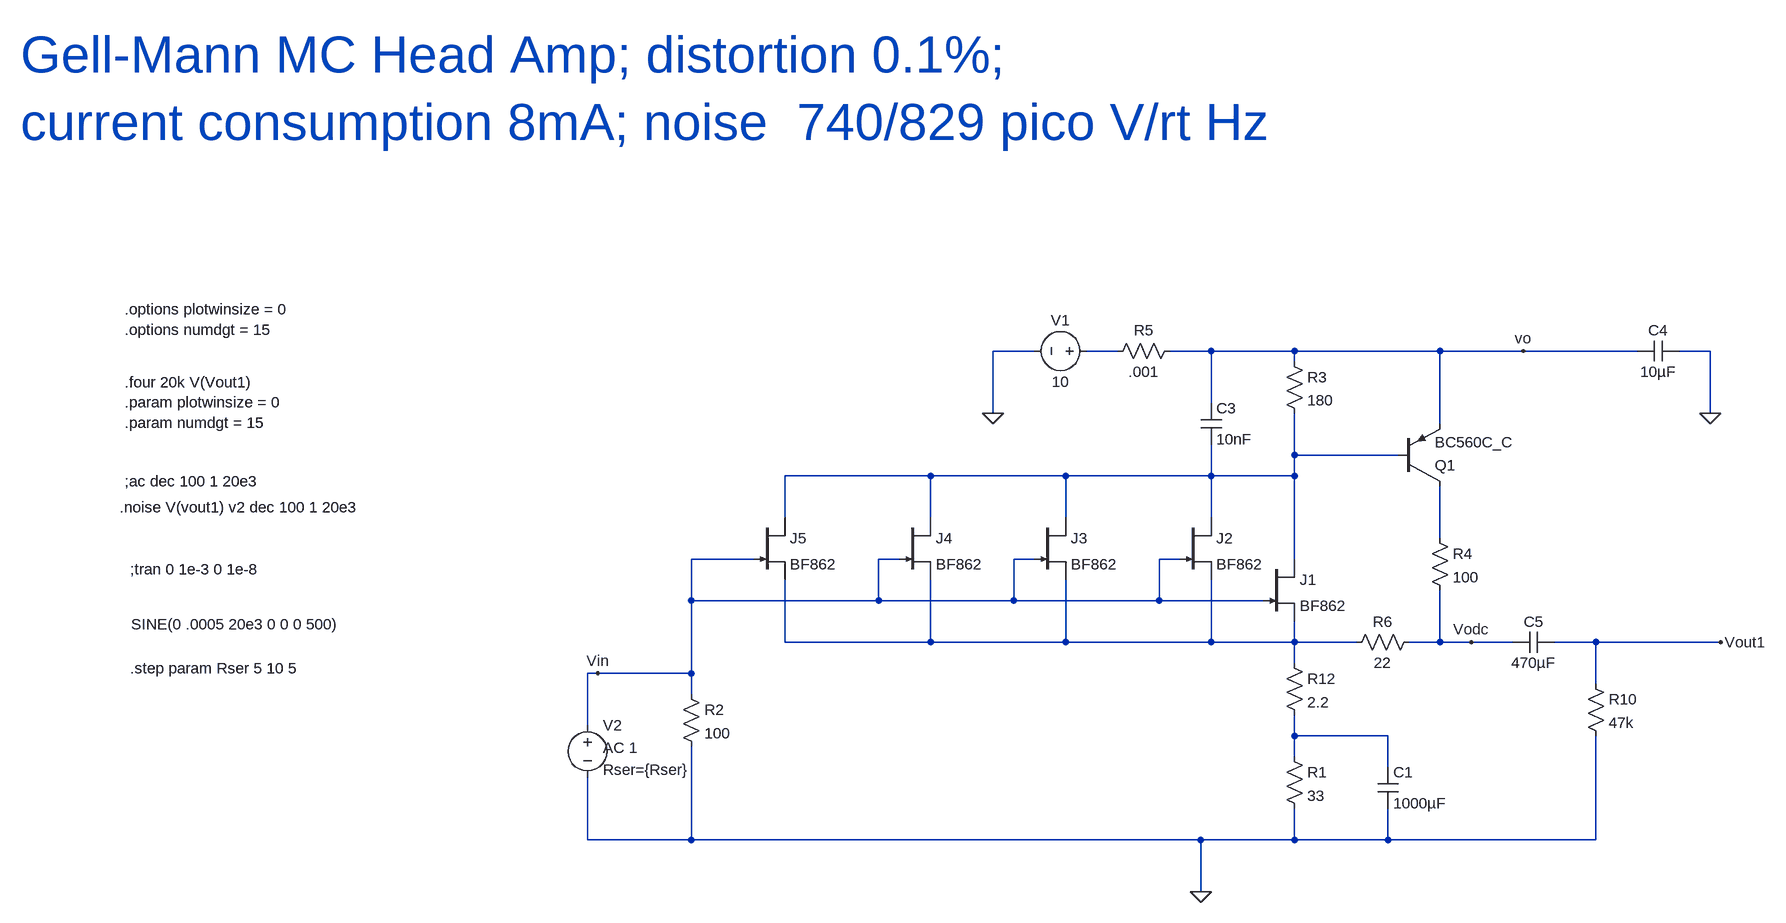
[diagram p0: schematic Gell_Mann.asc]
Gell_Mann.asc, the LTspice schematic file:
Version 4
SHEET 1 2320 680
WIRE 736 -496 672 -496
WIRE 864 -496 816 -496
WIRE 1008 -496 944 -496
WIRE 1136 -496 1008 -496
WIRE 1360 -496 1136 -496
WIRE 1488 -496 1360 -496
WIRE 1664 -496 1488 -496
WIRE 1776 -496 1728 -496
WIRE 1136 -480 1136 -496
WIRE 1008 -416 1008 -496
WIRE 672 -400 672 -496
WIRE 1776 -400 1776 -496
WIRE 1360 -384 1360 -496
WIRE 1136 -336 1136 -400
WIRE 1296 -336 1136 -336
WIRE 576 -304 352 -304
WIRE 784 -304 576 -304
WIRE 1008 -304 1008 -352
WIRE 1008 -304 784 -304
WIRE 1136 -304 1136 -336
WIRE 1136 -304 1008 -304
WIRE 352 -240 352 -304
WIRE 576 -240 576 -304
WIRE 784 -240 784 -304
WIRE 1008 -240 1008 -304
WIRE 1360 -208 1360 -288
WIRE 304 -176 208 -176
WIRE 528 -176 496 -176
WIRE 736 -176 704 -176
WIRE 960 -176 928 -176
WIRE 1136 -176 1136 -304
WIRE 208 -112 208 -176
WIRE 496 -112 496 -176
WIRE 496 -112 208 -112
WIRE 704 -112 704 -176
WIRE 704 -112 496 -112
WIRE 928 -112 928 -176
WIRE 928 -112 704 -112
WIRE 1088 -112 928 -112
WIRE 352 -48 352 -144
WIRE 576 -48 576 -144
WIRE 576 -48 352 -48
WIRE 784 -48 784 -144
WIRE 784 -48 576 -48
WIRE 1008 -48 1008 -144
WIRE 1008 -48 784 -48
WIRE 1136 -48 1136 -80
WIRE 1136 -48 1008 -48
WIRE 1232 -48 1136 -48
WIRE 1360 -48 1360 -128
WIRE 1360 -48 1312 -48
WIRE 1408 -48 1360 -48
WIRE 1472 -48 1408 -48
WIRE 1600 -48 1536 -48
WIRE 1792 -48 1600 -48
WIRE 1136 -16 1136 -48
WIRE 64 0 48 0
WIRE 208 0 208 -112
WIRE 208 0 64 0
WIRE 1600 16 1600 -48
WIRE 208 32 208 0
WIRE 48 80 48 0
WIRE 1136 96 1136 64
WIRE 1280 96 1136 96
WIRE 1136 128 1136 96
WIRE 1280 144 1280 96
WIRE 48 256 48 160
WIRE 208 256 208 112
WIRE 208 256 48 256
WIRE 992 256 208 256
WIRE 1136 256 1136 208
WIRE 1136 256 992 256
WIRE 1280 256 1280 208
WIRE 1280 256 1136 256
WIRE 1600 256 1600 96
WIRE 1600 256 1280 256
WIRE 992 336 992 256
FLAG 992 336 0
FLAG 672 -400 0
FLAG 1776 -400 0
FLAG 1792 -48 Vout1
FLAG 1408 -48 Vodc
FLAG 1488 -496 vo
FLAG 64 0 Vin
SYMBOL njf 1088 -176 R0
SYMATTR InstName J1
SYMATTR Value BF862
SYMBOL res 1120 112 R0
SYMATTR InstName R1
SYMATTR Value 33
SYMBOL res 1120 -496 R0
SYMATTR InstName R3
SYMATTR Value 180
SYMBOL voltage 832 -496 R90
WINDOW 0 -32 56 VBottom 2
WINDOW 3 32 56 VTop 2
WINDOW 123 2 56 VBottom 2
WINDOW 39 0 0 Left 2
SYMATTR InstName V1
SYMATTR Value 10
SYMBOL voltage 48 64 R0
WINDOW 3 -702 -140 Left 2
WINDOW 123 24 50 Left 2
WINDOW 39 24 84 Left 2
SYMATTR Value SINE(0 .0005 20e3 0 0 0 500)
SYMATTR Value2 AC 1
SYMATTR SpiceLine Rser={Rser}
SYMATTR InstName V2
SYMBOL cap 1728 -512 R90
WINDOW 0 0 32 VBottom 2
WINDOW 3 32 32 VTop 2
SYMATTR InstName C4
SYMATTR Value 10µF
SYMBOL pnp 1296 -288 M180
SYMATTR InstName Q1
SYMATTR Value BC560C_C
SYMBOL res 192 16 R0
SYMATTR InstName R2
SYMATTR Value 100
SYMBOL res 1344 -224 R0
SYMATTR InstName R4
SYMATTR Value 100
SYMBOL cap 992 -416 R0
SYMATTR InstName C3
SYMATTR Value 10nF
SYMBOL cap 1536 -64 R90
WINDOW 0 0 32 VBottom 2
WINDOW 3 32 32 VTop 2
SYMATTR InstName C5
SYMATTR Value 470µF
SYMBOL res 1584 0 R0
SYMATTR InstName R10
SYMATTR Value 47k
SYMBOL res 1120 -32 R0
SYMATTR InstName R12
SYMATTR Value 2.2
SYMBOL cap 1264 144 R0
SYMATTR InstName C1
SYMATTR Value 1000µF
SYMBOL res 960 -512 R90
WINDOW 0 0 56 VBottom 2
WINDOW 3 32 56 VTop 2
SYMATTR InstName R5
SYMATTR Value .001
SYMBOL njf 960 -240 R0
SYMATTR InstName J2
SYMATTR Value BF862
SYMBOL njf 736 -240 R0
SYMATTR InstName J3
SYMATTR Value BF862
SYMBOL njf 528 -240 R0
SYMATTR InstName J4
SYMATTR Value BF862
SYMBOL njf 304 -240 R0
SYMATTR InstName J5
SYMATTR Value BF862
SYMBOL res 1328 -64 R90
WINDOW 0 0 56 VBottom 2
WINDOW 3 32 56 VTop 2
SYMATTR InstName R6
SYMATTR Value 22
TEXT -664 -296 Left 2 !;ac dec 100 1 20e3
TEXT -656 -160 Left 2 !;tran 0 1e-3 0 1e-8
TEXT -672 -256 Left 2 !.noise V(vout1) v2 dec 100 1 20e3
TEXT -664 -448 Left 2 !.four 20k V(Vout1)\n.param plotwinsize = 0\n.param numdgt = 15
TEXT -664 -560 Left 2 !.options plotwinsize = 0\n.options numdgt = 15
TEXT -656 -8 Left 2 !.step param Rser 5 10 5
TEXT -824 -952 Left 6 ;Gell-Mann MC Head Amp; distortion 0.1%; \ncurrent consumption 8mA; noise  740/829 pico V/rt Hz

The netlist it stands for:
* Gell_Mann.asc
J1 N002 Vin N004 BF862
R1 N005 0 33
R3 vo N002 180
V1 N001 0 10
V2 Vin 0 SINE(0 .0005 20e3 0 0 0 500) AC 1 Rser={Rser}
C4 0 vo 10µF
Q1 N003 N002 vo 0 BC560C_C
R2 Vin 0 100
R4 N003 Vodc 100
C3 vo N002 10nF
C5 Vout1 Vodc 470µF
R10 Vout1 0 47k
R12 N004 N005 2.2
C1 N005 0 1000µF
R5 vo N001 .001
J2 N002 Vin N004 BF862
J3 N002 Vin N004 BF862
J4 N002 Vin N004 BF862
J5 N002 Vin N004 BF862
R6 Vodc N004 22
.model NPN NPN
.model PNP PNP
.lib standard.bjt
.model NJF NJF
.model PJF PJF
.lib standard.jft
;ac dec 100 1 20e3
;tran 0 1e-3 0 1e-8
.noise V(vout1) v2 dec 100 1 20e3
.four 20k V(Vout1)
.param plotwinsize = 0
.param numdgt = 15
.options plotwinsize = 0
.options numdgt = 15
.step param Rser 5 10 5
* Gell-Mann MC Head Amp; distortion 0.1%;
* current consumption 8mA; noise  740/829 pico V/rt Hz
.backanno
.end